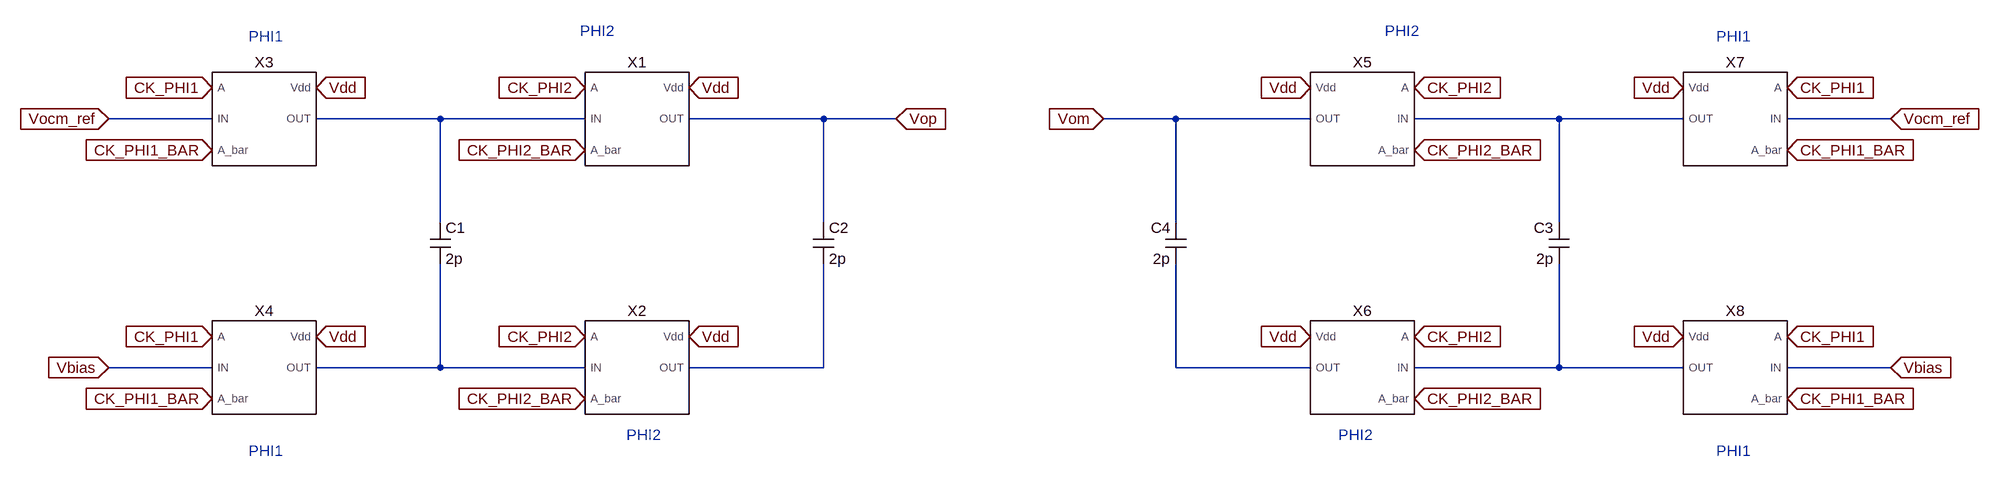
[diagram p0: schematic Draft1.asc]
Draft1.asc, the LTspice schematic file:
Version 4
SHEET 1 2472 704
WIRE -288 176 -448 176
WIRE 64 176 -128 176
WIRE 288 176 64 176
WIRE 656 176 448 176
WIRE 768 176 656 176
WIRE 1200 176 1088 176
WIRE 1408 176 1200 176
WIRE 1792 176 1568 176
WIRE 1984 176 1792 176
WIRE 2304 176 2144 176
WIRE 64 336 64 176
WIRE 656 336 656 176
WIRE 1200 336 1200 176
WIRE 1792 336 1792 176
WIRE -288 560 -448 560
WIRE 64 560 64 400
WIRE 64 560 -128 560
WIRE 288 560 64 560
WIRE 656 560 656 400
WIRE 656 560 448 560
WIRE 1200 560 1200 400
WIRE 1408 560 1200 560
WIRE 1792 560 1792 400
WIRE 1792 560 1568 560
WIRE 1984 560 1792 560
WIRE 2304 560 2144 560
FLAG -448 176 Vocm_ref
IOPIN -448 176 In
FLAG 768 176 Vop
IOPIN 768 176 In
FLAG -128 128 Vdd
IOPIN -128 128 In
FLAG 448 128 Vdd
IOPIN 448 128 In
FLAG 448 512 Vdd
IOPIN 448 512 In
FLAG -128 512 Vdd
IOPIN -128 512 In
FLAG -288 128 CK_PHI1
IOPIN -288 128 In
FLAG -288 512 CK_PHI1
IOPIN -288 512 In
FLAG 288 128 CK_PHI2
IOPIN 288 128 In
FLAG 288 512 CK_PHI2
IOPIN 288 512 In
FLAG -288 224 CK_PHI1_BAR
IOPIN -288 224 In
FLAG -288 608 CK_PHI1_BAR
IOPIN -288 608 In
FLAG 288 224 CK_PHI2_BAR
IOPIN 288 224 In
FLAG 288 608 CK_PHI2_BAR
IOPIN 288 608 In
FLAG 2304 176 Vocm_ref
IOPIN 2304 176 In
FLAG 1088 176 Vom
IOPIN 1088 176 In
FLAG 1984 128 Vdd
IOPIN 1984 128 In
FLAG 1408 128 Vdd
IOPIN 1408 128 In
FLAG 1408 512 Vdd
IOPIN 1408 512 In
FLAG 1984 512 Vdd
IOPIN 1984 512 In
FLAG 2144 128 CK_PHI1
IOPIN 2144 128 In
FLAG 2144 512 CK_PHI1
IOPIN 2144 512 In
FLAG 1568 128 CK_PHI2
IOPIN 1568 128 In
FLAG 1568 512 CK_PHI2
IOPIN 1568 512 In
FLAG 2144 224 CK_PHI1_BAR
IOPIN 2144 224 In
FLAG 2144 608 CK_PHI1_BAR
IOPIN 2144 608 In
FLAG 1568 224 CK_PHI2_BAR
IOPIN 1568 224 In
FLAG 1568 608 CK_PHI2_BAR
IOPIN 1568 608 In
FLAG -448 560 Vbias
IOPIN -448 560 In
FLAG 2304 560 Vbias
IOPIN 2304 560 In
SYMBOL tgate 368 176 R0
SYMATTR InstName X1
SYMBOL tgate 368 560 R0
SYMATTR InstName X2
SYMBOL tgate -208 176 R0
SYMATTR InstName X3
SYMBOL tgate -208 560 R0
SYMATTR InstName X4
SYMBOL cap 48 336 R0
SYMATTR InstName C1
SYMATTR Value 2p
SYMBOL cap 640 336 R0
SYMATTR InstName C2
SYMATTR Value 2p
SYMBOL tgate 1488 176 M0
SYMATTR InstName X5
SYMBOL tgate 1488 560 M0
SYMATTR InstName X6
SYMBOL tgate 2064 176 M0
SYMATTR InstName X7
SYMBOL tgate 2064 560 M0
SYMATTR InstName X8
SYMBOL cap 1808 336 M0
SYMATTR InstName C3
SYMATTR Value 2p
SYMBOL cap 1216 336 M0
SYMATTR InstName C4
SYMATTR Value 2p
TEXT 280 40 Left 2 ;PHI2
TEXT 352 664 Left 2 ;PHI2
TEXT -232 48 Left 2 ;PHI1
TEXT -232 688 Left 2 ;PHI1
TEXT 1576 40 Right 2 ;PHI2
TEXT 1504 664 Right 2 ;PHI2
TEXT 2088 48 Right 2 ;PHI1
TEXT 2088 688 Right 2 ;PHI1

The netlist it stands for:
* Draft1.asc
XX1 CK_PHI2 CK_PHI2_BAR N001 Vdd Vop tgate L=0.28u Wn=1u Wp=3u M=1  ; pins A A_bar IN Vdd OUT
XX2 CK_PHI2 CK_PHI2_BAR N003 Vdd N004 tgate L=0.28u Wn=1u Wp=3u M=1  ; pins A A_bar IN Vdd OUT
XX3 CK_PHI1 CK_PHI1_BAR Vocm_ref Vdd N001 tgate L=0.28u Wn=1u Wp=3u M=1  ; pins A A_bar IN Vdd OUT
XX4 CK_PHI1 CK_PHI1_BAR Vbias Vdd N003 tgate L=0.28u Wn=1u Wp=3u M=1  ; pins A A_bar IN Vdd OUT
C1 N001 N003 2p
C2 Vop N004 2p
XX5 CK_PHI2 CK_PHI2_BAR N002 Vdd Vom tgate L=0.28u Wn=1u Wp=3u M=1  ; pins A A_bar IN Vdd OUT
XX6 CK_PHI2 CK_PHI2_BAR N006 Vdd N005 tgate L=0.28u Wn=1u Wp=3u M=1  ; pins A A_bar IN Vdd OUT
XX7 CK_PHI1 CK_PHI1_BAR Vocm_ref Vdd N002 tgate L=0.28u Wn=1u Wp=3u M=1  ; pins A A_bar IN Vdd OUT
XX8 CK_PHI1 CK_PHI1_BAR Vbias Vdd N006 tgate L=0.28u Wn=1u Wp=3u M=1  ; pins A A_bar IN Vdd OUT
C3 N002 N006 2p
C4 Vom N005 2p
* PHI2
* PHI2
* PHI1
* PHI1
* PHI2
* PHI2
* PHI1
* PHI1
.backanno
.end